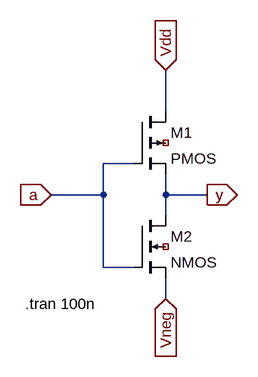
[diagram p0: schematic notsymb.asc]
notsymb.asc, the LTspice schematic file:
Version 4
SHEET 1 880 680
WIRE 560 64 560 0
WIRE 512 144 464 144
WIRE 464 192 464 144
WIRE 464 192 384 192
WIRE 560 192 560 160
WIRE 624 192 560 192
WIRE 560 224 560 192
WIRE 464 304 464 192
WIRE 512 304 464 304
WIRE 560 352 560 320
FLAG 384 192 a
IOPIN 384 192 In
FLAG 560 0 Vdd
IOPIN 560 0 In
FLAG 560 352 Vneg
IOPIN 560 352 In
FLAG 624 192 y
IOPIN 624 192 Out
FLAG 624 192 y
IOPIN 624 192 Out
SYMBOL pmos4 512 64 R0
SYMATTR InstName M1
SYMBOL nmos4 512 224 R0
SYMATTR InstName M2
TEXT 344 360 Left 2 !.tran 100n

The netlist it stands for:
* notsymb.asc
M1 Vdd a y NC_01 PMOS
M2 y a Vneg NC_02 NMOS
.model NMOS NMOS
.model PMOS PMOS
.lib standard.mos
.tran 100n
.backanno
.end